# Altium project OSV_PSB_V2I1.PrjPcb (part 2 of 3)
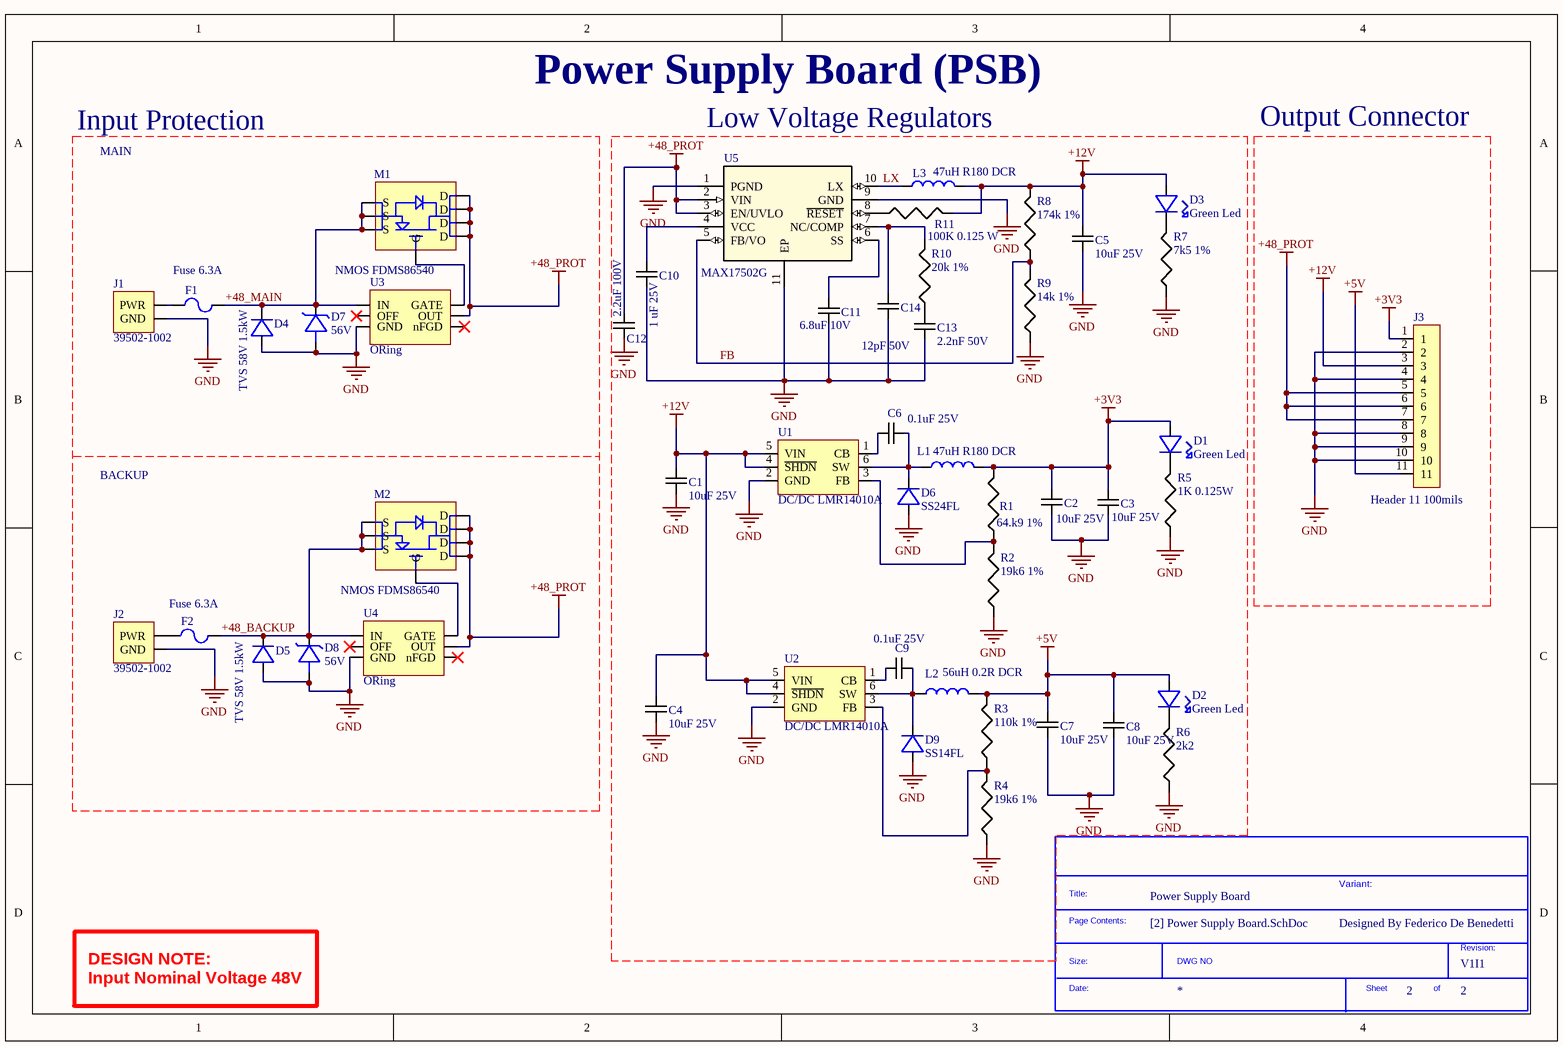
[diagram p2: [2] Power Supply Board.SchDoc]

## Sheet [2] Power Supply Board.SchDoc (continued)
### Library data of the parts
C1-C5 C7 C8 = GRM21BC81E106ME51L: CAP CER 10UF 25V X6S 0805; Manufacturer: Murata; Tolerance: 20%; Supplier 1: Digi-Key; Manufacturer Part Number: GRM21BC81E106ME51L; RoHS: Yes; Category: Ceramic Capacitors; Stock 1: 169515; Pricing 1: 1=0,37000, 10=0,25900, 100=0,15560, 500=0,11670, 1000=0,09854 (USD); Mount: Surface Mount; Case/Package: 0805; Case Code (Imperial): 0805; Case Code (Metric): 2012; Min Operating Temperature: -55°C; Max Operating Temperature: 105°C; Voltage Rating (DC): 25V; Dielectric: X6S; Packaging: Cut Tape; Capacitance: 10uF; Voltage Rating: 25V; Length: 0.079inch; Width: 0.049inch; Thickness: 0.055inch; ComponentLink1URL: http://search.murata.co.jp/Ceramy/image/img/A01X/G101/ENG/GRM21BC81E106ME51-01.pdf?src-supplier=Digi-Key; ComponentLink1Description: http://search.murata.co.jp/Ceramy/image/img/A01X/G101/ENG/GRM21BC81E106ME51-01.pdf?src-supplier=Digi-Key; Supplier Part Number 1: 490-10503-1-ND
C6 C9 = 08053C104KAT2A: CAP CER 0.1UF 25V X7R 0805; Manufacturer: Kyocera AVX; Capacitance: 100nF; Tolerance: 10%; Dissipation Factor: 3%; Insulation Resistance: 100GR; Supplier 1: Digi-Key; Manufacturer Part Number: 08053C104KAT2A; Stock 1: 40000; Pricing 1: 1=0.2, 10=0.144, 100=0.0675, 500=0.04736, 1000=0.0392 (USD); Mount: PCB,Surface Mount; Case/Package: 0805; Number of Pins: 2; Case Code (Imperial): 0805; Case Code (Metric): 2012; Contact Plating: Matte,Tin; Min Operating Temperature: -55°C; Max Operating Temperature: 125°C; Voltage Rating: 25V; Packaging: Tape and Reel; Package Quantity: 1; Dielectric: X7R; Voltage Rating (DC): 25V; Termination: SMD/SMT; Voltage: 25V; Length: 2.01mm; Height: 0.94mm; Width: 0.049inch; Thickness: 0.037inch; Depth: 1.25mm; Radiation Hardening: No; REACH SVHC: No SVHC; Lead Free: Lead Free; ComponentLink1URL: http://uk.rs-online.com/webdocs/13cc/0900766b813cc99b.pdf; ComponentLink1Description: http://uk.rs-online.com/webdocs/13cc/0900766b813cc99b.pdf; ComponentLink2URL: http://www.avx.com/docs/catalogs/cx7r.pdf; ComponentLink2Description: http://www.avx.com/docs/catalogs/cx7r.pdf; ComponentLink3URL: http://www.jameco.com/Jameco/Products/ProdDS/1929276.pdf; ComponentLink3Description: http://www.jameco.com/Jameco/Products/ProdDS/1929276.pdf; ComponentLink4URL: http://datasheets.avx.com/AutoMLCC.pdf; ComponentLink4Description: http://datasheets.avx.com/AutoMLCC.pdf; ComponentLink5URL: http://avx.com/docs/Catalogs/cx7r.pdf; ComponentLink5Description: http://avx.com/docs/Catalogs/cx7r.pdf; ComponentLink6URL: http://www.alliedelec.com/m/d/a24bb5190bea413b2ff164816f55e87c.pdf; ComponentLink6Description: http://www.alliedelec.com/m/d/a24bb5190bea413b2ff164816f55e87c.pdf; ComponentLink7URL: http://www.mouser.com/ds/2/40/X7RDielectric-777024.pdf; ComponentLink7Description: http://www.mouser.com/ds/2/40/X7RDielectric-777024.pdf; ComponentLink8URL: http://catalogs.avx.com/SurfaceMount.pdf; ComponentLink8Description: http://catalogs.avx.com/SurfaceMount.pdf; Supplier Part Number 1: 478-3755-1-ND
C10 = CL21B105KAFNNNE: Cap Ceramic 1uF 25V X7R 10% SMD 0805 125C T/R; Manufacturer: Samsung; Supplier 1: Digi-Key; Manufacturer Part Number: CL21B105KAFNNNE; Stock 1: 1714091; Pricing 1: 1=0.1, 10=0.076, 100=0.0338, 500=0.02416, 1000=0.01898 (USD); Mount: Surface Mount; Case/Package: 0805; Contact Plating: Tin; Case Code (Metric): 2012; Case Code (Imperial): 0805; Min Operating Temperature: -55°C; Max Operating Temperature: 125°C; Packaging: Tape and Reel; Package Quantity: 1; Capacitance: 1uF; Tolerance: 10%; Voltage Rating: 25V; Dielectric: X7R; Voltage: 25V; Voltage Rating (DC): 25V; Length: 2mm; Height: 1.25mm; Depth: 1.25mm; Width: 0.049inch; Thickness: 0.053inch; Radiation Hardening: No; Lead Free: Lead Free; ComponentLink1URL: https://media.digikey.com/pdf/Data%20Sheets/Samsung%20PDFs/CL_Series_MLCC_ds.pdf?src-supplier=Digi-Key; ComponentLink1Description: https://media.digikey.com/pdf/Data%20Sheets/Samsung%20PDFs/CL_Series_MLCC_ds.pdf?src-supplier=Digi-Key; ComponentLink2URL: https://www.verical.com/server-webapp/html/getDatasheet?partID=355205&src-supplier=Verical; ComponentLink2Description: https://www.verical.com/server-webapp/html/getDatasheet?partID=355205&src-supplier=Verical; Supplier Part Number 1: 1276-1066-1-ND
C11 = C2012X7R1A685K125AC: CAP CER 6.8UF 10V X7R 0805; Manufacturer: TDK; Dielectric Material: Ceramic; Tolerance: 10%; Supplier 1: Digi-Key; Manufacturer Part Number: C2012X7R1A685K125AC; RoHS: Yes; Category: Ceramic Capacitors; Stock 1: 4078; Pricing 1: 1=0,46000, 10=0,31600, 100=0,18980, 500=0,14232, 1000=0,12018 (USD); Mount: Surface Mount; Case/Package: 0805; Case Code (Metric): 5032; Case Code (Imperial): 2012; Min Operating Temperature: -55°C; Max Operating Temperature: 125°C; Termination: SMD/SMT; Voltage Rating (DC): 10V; Dielectric: X7R; Package Quantity: 2000; Packaging: Tape and Reel; Capacitance: 6.8uF; Voltage Rating: 10V; Length: 0.079inch; Width: 0.049inch; Thickness: 0.057inch; Lead Free: Lead Free; ComponentLink1URL: https://datasheet.ciiva.com/14909/tdkmlcccaprange-14909278.pdf?src-supplier=Digi-Key; ComponentLink1Description: https://datasheet.ciiva.com/14909/tdkmlcccaprange-14909278.pdf?src-supplier=Digi-Key; ComponentLink2URL: https://datasheet.ciiva.com/14909/tdkmlcccaprange-14909279.pdf?src-supplier=Digi-Key; ComponentLink2Description: https://datasheet.ciiva.com/14909/tdkmlcccaprange-14909279.pdf?src-supplier=Digi-Key; Supplier Part Number 1: 445-14529-1-ND
C12 = GCM31CC72A225KE02L: Cap Ceramic 2.2uF 100V X7S 10% Pad SMD 1206 125C Automotive T/R; Manufacturer: Murata; Supplier 1: Digi-Key; Manufacturer Part Number: GCM31CC72A225KE02L; RoHS: No; Category: Ceramic Capacitors; Stock 1: 99576; Pricing 1: 1=0,90000, 10=0,66100, 100=0,45330, 500=0,35886, 1000=0,30220 (USD); Mount: Surface Mount; Case/Package: 1206; Case Code (Imperial): 1206; Case Code (Metric): 3216; Min Operating Temperature: -55°C; Max Operating Temperature: 125°C; Packaging: Cut Tape; Capacitance: 2.2uF; Tolerance: 10%; Voltage Rating: 100V; Ratings: AEC-Q200; ComponentLink1URL: http://search.murata.co.jp/Ceramy/image/img/A01X/partnumbering_e_02.pdf?src-supplier=Digi-Key; ComponentLink1Description: http://search.murata.co.jp/Ceramy/image/img/A01X/partnumbering_e_02.pdf?src-supplier=Digi-Key; ComponentLink2URL: http://search.murata.co.jp/Ceramy/image/img/A01X/G101/ENG/GCM31CC72A225KE02-01.pdf?src-supplier=Digi-Key; ComponentLink2Description: http://search.murata.co.jp/Ceramy/image/img/A01X/G101/ENG/GCM31CC72A225KE02-01.pdf?src-supplier=Digi-Key; Supplier Part Number 1: 490-14438-1-ND
C13 = C0805C222K5RACTU: Cap Ceramic 2.2nF 50V X7R 10% SMD 0805 125°C Paper T/R; Manufacturer: KEMET; Supplier 1: Digi-Key; Manufacturer Part Number: C0805C222K5RACTU; RoHS: Yes; Category: Ceramic Capacitors; Stock 1: 406273; Pricing 1: 1=0,10000, 10=0,06000, 100=0,02670, 500=0,01906, 1000=0,01497 (USD); Mount: Surface Mount; Case/Package: 0805; Dielectric Material: Ceramic; Min Operating Temperature: -55°C; Max Operating Temperature: 125°C; Tolerance: 10%; Packaging: Tape and Reel; Capacitance: 2.2nF; Dielectric: X7R; Voltage Rating (DC): 50V; Voltage: 50V; Length: 2mm; Height: 0.78mm; Depth: 1.25mm; Radiation Hardening: No; ComponentLink1URL: https://datasheet.ciiva.com/28692/1851736-28692973.pdf?src-supplier=Element14; ComponentLink1Description: https://datasheet.ciiva.com/28692/1851736-28692973.pdf?src-supplier=Element14; ComponentLink2URL: https://datasheet.ciiva.com/28584/kem-c1002-x7r-smd-28584143.pdf?src-supplier=Element14; ComponentLink2Description: https://datasheet.ciiva.com/28584/kem-c1002-x7r-smd-28584143.pdf?src-supplier=Element14; Supplier Part Number 1: 399-1151-1-ND
C14 = C0805C120J5GACTU: Cap Ceramic 12PF, 50V, 0805, REEL; Manufacturer: KEMET; Tolerance: 5%; Dielectric: C0G; Dissipation Factor: 0.1%; Temperature Coefficient: 30ppm/°C; Supplier 1: Digi-Key; Manufacturer Part Number: C0805C120J5GACTU; RoHS: Yes; Category: Ceramic Capacitors; Stock 1: 92109; Pricing 1: 1=0,15000, 10=0,10700, 100=0,05010, 500=0,03512, 1000=0,02908 (USD); Mount: Surface Mount,PCB; Case/Package: 0805; Number of Pins: 2; Contact Material: Tin; Case Code (Metric): 2012; Case Code (Imperial): 0805; Dielectric Material: Ceramic; Min Operating Temperature: -55°C; Max Operating Temperature: 125°C; Package Quantity: 1; Capacitance: 12pF; Voltage Rating: 50V; Packaging: Tape and Reel; Voltage Rating (DC): 50V; Termination: SMD/SMT; Voltage: 50V; Length: 2mm; Height: 0.78mm; Width: 0.049inch; Thickness: 0.035inch; Lead Pitch: 0.75mm; Depth: 1.25mm; Radiation Hardening: No; REACH SVHC: No SVHC; Lead Free: Lead Free; ComponentLink1URL: https://datasheet.ciiva.com/6136/1732692-6136713.pdf?src-supplier=Farnell; ComponentLink1Description: https://datasheet.ciiva.com/6136/1732692-6136713.pdf?src-supplier=Farnell; ComponentLink2URL: https://datasheet.ciiva.com/144/docfinderpartnumber-c0805c120j5gactu-144980.pdf?src-supplier=Digi-Key; ComponentLink2Description: https://datasheet.ciiva.com/144/docfinderpartnumber-c0805c120j5gactu-144980.pdf?src-supplier=Digi-Key; ComponentLink3URL: https://datasheet.ciiva.com/11463/kem-c1003-c0g-smd-11463493.pdf?src-supplier=Avnet; ComponentLink3Description: https://datasheet.ciiva.com/11463/kem-c1003-c0g-smd-11463493.pdf?src-supplier=Avnet; ComponentLink4URL: https://datasheet.ciiva.com/18193/getdatasheetpartid-179336-18193526.pdf?src-supplier=Verical; ComponentLink4Description: https://datasheet.ciiva.com/18193/getdatasheetpartid-179336-18193526.pdf?src-supplier=Verical; ComponentLink5URL: https://datasheet.ciiva.com/5418/kem-c1003-c0g-smd-356956-5418089.pdf?src-supplier=Mouser; ComponentLink5Description: https://datasheet.ciiva.com/5418/kem-c1003-c0g-smd-356956-5418089.pdf?src-supplier=Mouser; ComponentLink6URL: https://datasheet.ciiva.com/7842/1732692-7842203.pdf?src-supplier=Element14; ComponentLink6Description: https://datasheet.ciiva.com/7842/1732692-7842203.pdf?src-supplier=Element14; ComponentLink7URL: https://datasheet.ciiva.com/7842/1732692-7842204.pdf?src-supplier=Element14; ComponentLink7Description: https://datasheet.ciiva.com/7842/1732692-7842204.pdf?src-supplier=Element14; ComponentLink8URL: https://datasheet.ciiva.com/14586/70095383-14586716.pdf?src-supplier=Allied+Electronics; ComponentLink8Description: https://datasheet.ciiva.com/14586/70095383-14586716.pdf?src-supplier=Allied+Electronics; ComponentLink9URL: https://datasheet.ciiva.com/28696/1789732-28696013.pdf?src-supplier=Element14; ComponentLink9Description: https://datasheet.ciiva.com/28696/1789732-28696013.pdf?src-supplier=Element14; Supplier Part Number 1: 399-1110-1-ND
D1-D3 = 598-8170-107F: LED 0805 GREEN 20MCD; Manufacturer: Dialight; Lens Color: Colorless,Clear; Lens Transparency: Clear; Reverse Voltage: 5V; Lens Style: Flat,Rectangular,Clear,Diffused,Colorless; Forward Voltage: 2.4V; Viewing Angle: 140°; Wavelength: 570nm; Forward Current: 20mA; Number of LEDs: 1; Power Dissipation: 60mW; Lens Size: 1.25mm; Supplier 1: Digi-Key; Manufacturer Part Number: 598-8170-107F; RoHS: Yes; Category: LEDs; Stock 1: 101069; Pricing 1: 1=0,39000, 10=0,28200, 100=0,12520, 500=0,08766, 1000=0,07201 (USD); Mount: Surface Mount; Case/Package: 0805; Number of Pins: 2; Case Code (Imperial): 0805; Case Code (Metric): 2012; Color: Green; Min Operating Temperature: -30°C; Max Operating Temperature: 85°C; Package Quantity: 3000; Packaging: Tape and Reel; Luminous Intensity: 20mcd; Illumination Color: Green; Test Current: 20mA; Dominant Wavelength: 570nm; Number of Elements: 1; Length: 2mm; Height: 0.8mm; Width: 1.25mm; Depth: 1.25mm; Radiation Hardening: No; REACH SVHC: No SVHC; Lead Free: Lead Free; ComponentLink1URL: https://datasheet.ciiva.com/11774/0900766b80ae2984-11774107.pdf?src-supplier=RSComponents; ComponentLink1Description: https://datasheet.ciiva.com/11774/0900766b80ae2984-11774107.pdf?src-supplier=RSComponents; ComponentLink2URL: https://datasheet.ciiva.com/15117/getdatasheetpartid-104614-15117453.pdf?src-supplier=Verical; ComponentLink2Description: https://datasheet.ciiva.com/15117/getdatasheetpartid-104614-15117453.pdf?src-supplier=Verical; ComponentLink3URL: https://datasheet.ciiva.com/2110/smt-selector-guide-2110053.pdf?src-supplier=Digi-Key; ComponentLink3Description: https://datasheet.ciiva.com/2110/smt-selector-guide-2110053.pdf?src-supplier=Digi-Key; ComponentLink4URL: https://datasheet.ciiva.com/1243/25662-1243901.pdf?src-supplier=Element14; ComponentLink4Description: https://datasheet.ciiva.com/1243/25662-1243901.pdf?src-supplier=Element14; ComponentLink5URL: https://datasheet.ciiva.com/30132/mdei5980805-a-w-30132781.pdf?src-supplier=Onlinecomponents.com; ComponentLink5Description: https://datasheet.ciiva.com/30132/mdei5980805-a-w-30132781.pdf?src-supplier=Onlinecomponents.com; ComponentLink6URL: https://datasheet.ciiva.com/2110/smt-selector-guide-2110051.pdf?src-supplier=Digi-Key; ComponentLink6Description: https://datasheet.ciiva.com/2110/smt-selector-guide-2110051.pdf?src-supplier=Digi-Key; ComponentLink7URL: https://datasheet.ciiva.com/2110/smt-selector-guide-2110052.pdf?src-supplier=Digi-Key; ComponentLink7Description: https://datasheet.ciiva.com/2110/smt-selector-guide-2110052.pdf?src-supplier=Digi-Key; ComponentLink8URL: https://datasheet.ciiva.com/15965/mdei5980805-a-w-15965496.pdf?src-supplier=Onlinecomponents.com; ComponentLink8Description: https://datasheet.ciiva.com/15965/mdei5980805-a-w-15965496.pdf?src-supplier=Onlinecomponents.com; ComponentLink9URL: https://datasheet.ciiva.com/22748/1484480-22748121.pdf?src-supplier=Element14; ComponentLink9Description: https://datasheet.ciiva.com/22748/1484480-22748121.pdf?src-supplier=Element14; ComponentLink10URL: https://datasheet.ciiva.com/1243/25662-1243902.pdf?src-supplier=Element14; ComponentLink10Description: https://datasheet.ciiva.com/1243/25662-1243902.pdf?src-supplier=Element14; Supplier Part Number 1: 350-2044-1-ND
D4 D5 = SMCJ58CA: TVS DIODE 58VWM 93.6VC SMC; Manufacturer: Littelfuse; Leakage Current: 1uA; Breakdown Voltage: 64.4V; Number of Channels: 1; Clamping Voltage: 93.6V; Polarity: Bidirectional; Power Line Protection: No; Peak Pulse Current: 16.1A; Test Current: 1mA; Max Breakdown Voltage: 71.2V; Max Power Dissipation: 6.5W; Supplier 1: Digi-Key; Manufacturer Part Number: SMCJ58CA; RoHS: Yes; Category: TVS Diodes; Stock 1: 5077; Pricing 1: 1=0,61000, 10=0,52500, 25=0,49000, 100=0,36400, 250=0,34580, 500=0,28420, 1000=0,23100 (USD); Mount: Surface Mount; Number of Pins: 2; Min Operating Temperature: -65°C; Max Operating Temperature: 150°C; Voltage Rating (DC): 58V; Peak Pulse Power: 1.5kW; Termination: SMD/SMT; Number of Bidirectional Channels: 1; Direction: Bidirectional; Reverse Standoff Voltage: 58V; Min Breakdown Voltage: 64.4V; Reverse Breakdown Voltage: 64.4V; Packaging: Tape and Reel; Number of Elements: 1; Package Quantity: 3000; Operating Supply Voltage: 58V; Power Dissipation: 1.5kW; Max Surge Current: 16.1A; Composition: Zener; Length: 8.13mm; Height: 2.62mm; Width: 6.22mm; Lead Free: Lead Free; REACH SVHC: No SVHC; ComponentLink1URL: https://datasheet.ciiva.com/16388/smcj58ca-16388266.pdf?src-supplier=Future+Electronics; ComponentLink1Description: https://datasheet.ciiva.com/16388/smcj58ca-16388266.pdf?src-supplier=Future+Electronics; ComponentLink2URL: https://datasheet.ciiva.com/4509/littelfuse-tvs-diode-smcj-62645-4509016.pdf?src-supplier=Mouser; ComponentLink2Description: https://datasheet.ciiva.com/4509/littelfuse-tvs-diode-smcj-62645-4509016.pdf?src-supplier=Mouser; ComponentLink3URL: https://datasheet.ciiva.com/332/littelfuse-tvs-diode-smcj-datasheet-pdf-332399.pdf?src-supplier=Digi-Key; ComponentLink3Description: https://datasheet.ciiva.com/332/littelfuse-tvs-diode-smcj-datasheet-pdf-332399.pdf?src-supplier=Digi-Key; ComponentLink4URL: https://datasheet.ciiva.com/332/littelfuse-tvs-diode-smcj-datasheet-pdf-332397.pdf?src-supplier=Digi-Key; ComponentLink4Description: https://datasheet.ciiva.com/332/littelfuse-tvs-diode-smcj-datasheet-pdf-332397.pdf?src-supplier=Digi-Key; ComponentLink5URL: https://datasheet.ciiva.com/332/littelfuse-tvs-diode-smcj-datasheet-pdf-332398.pdf?src-supplier=Digi-Key; ComponentLink5Description: https://datasheet.ciiva.com/332/littelfuse-tvs-diode-smcj-datasheet-pdf-332398.pdf?src-supplier=Digi-Key; Supplier Part Number 1: SMCJ58CALFCT-ND
D6 = SS24FL: Diode SCHOTTKY  40V 2S SOD123F; Manufacturer: ON Semiconductor / Fairchild; Average Rectified Current: 2A; Reverse Recovery Time: 9.495ns; Element Configuration: Single; Max Forward Surge Current (Ifsm): 50A; Supplier 1: Digi-Key; Manufacturer Part Number: SS24FL; RoHS: Yes; Category: Rectifier Diodes; Stock 1: 15493; Pricing 1: 1=0,31000, 10=0,25000, 25=0,20960, 100=0,10250, 250=0,10088, 500=0,08552, 1000=0,05942 (USD); Mount: Surface Mount; Case/Package: SOD; Number of Pins: 2; Weight: 0.0276g; Packaging: Tape and Reel; Max Reverse Voltage (DC): 40V; Max Repetitive Reverse Voltage (Vrrm): 40V; ComponentLink1URL: http://www.farnell.com/datasheets/2552652.pdf?src-supplier=Farnell; ComponentLink1Description: http://www.farnell.com/datasheets/2552652.pdf?src-supplier=Farnell; ComponentLink2URL: https://www.fairchildsemi.com/datasheets/SS/SS24FL.pdf?src-supplier=Digi-Key; ComponentLink2Description: https://www.fairchildsemi.com/datasheets/SS/SS24FL.pdf?src-supplier=Digi-Key; ComponentLink3URL: http://www.farnell.com/datasheets/2552652.pdf?src-supplier=Newark; ComponentLink3Description: http://www.farnell.com/datasheets/2552652.pdf?src-supplier=Newark; ComponentLink4URL: http://www.farnell.com/datasheets/2552652.pdf?src-supplier=Element14; ComponentLink4Description: http://www.farnell.com/datasheets/2552652.pdf?src-supplier=Element14; Supplier Part Number 1: SS24FLCT-ND
D7 D8 = 1SMA5943BT3G: Diodes Zener 56V 1.5W; Manufacturer: ON Semiconductor; Impedance: 86R; Max Reverse Leakage Current: 500nA; Voltage Tolerance: 5%; Power Dissipation: 500mW; Zener Current: 27mA; Test Current: 6.7mA; Breakdown Voltage: 58.8V; Forward Voltage: 1.5V; Element Configuration: Single; Supplier 1: Digi-Key; Manufacturer Part Number: 1SMA5943BT3G; RoHS: Yes; Category: Zener Diodes; Stock 1: 25856; Pricing 1: 1=0,43000, 10=0,32200, 25=0,29040, 100=0,15310, 250=0,15152, 500=0,13570, 1000=0,10560, 2500=0,09662 (USD); Case/Package: SMA; Number of Pins: 2; Min Operating Temperature: -65°C; Max Operating Temperature: 150°C; Packaging: Tape and Reel; Zener Voltage: 56V; Max Power Dissipation: 1.5W; Power Rating: 1.5W; Voltage Rating (DC): 56V; Tolerance: 5%; Working Voltage: 56V; Package Quantity: 1; Peak Reverse Current: 500nA; Length: 4.57mm; Height: 2.05mm; Width: 2.92mm; Radiation Hardening: No; Lead Free: Lead Free; Halogen Free: Halogen Free; REACH SVHC: No SVHC; ComponentLink1URL: https://datasheet.ciiva.com/15142/getdatasheetpartid-53895-15142138.pdf?src-supplier=Verical; ComponentLink1Description: https://datasheet.ciiva.com/15142/getdatasheetpartid-53895-15142138.pdf?src-supplier=Verical; ComponentLink2URL: https://datasheet.ciiva.com/4733/1sma5913bt3-d-4733669.pdf?src-supplier=Mouser; ComponentLink2Description: https://datasheet.ciiva.com/4733/1sma5913bt3-d-4733669.pdf?src-supplier=Mouser; ComponentLink3URL: https://datasheet.ciiva.com/16311/1sma5913bt3-d-16311897.pdf?src-supplier=Future+Electronics; ComponentLink3Description: https://datasheet.ciiva.com/16311/1sma5913bt3-d-16311897.pdf?src-supplier=Future+Electronics; ComponentLink4URL: https://datasheet.ciiva.com/6388/1sma5913bt3-d-6388892.pdf?src-supplier=Digi-Key; ComponentLink4Description: https://datasheet.ciiva.com/6388/1sma5913bt3-d-6388892.pdf?src-supplier=Digi-Key; ComponentLink5URL: https://datasheet.ciiva.com/6388/1sma5913bt3-d-6388890.pdf?src-supplier=Digi-Key; ComponentLink5Description: https://datasheet.ciiva.com/6388/1sma5913bt3-d-6388890.pdf?src-supplier=Digi-Key; ComponentLink6URL: https://datasheet.ciiva.com/6388/1sma5913bt3-d-6388891.pdf?src-supplier=Digi-Key; ComponentLink6Description: https://datasheet.ciiva.com/6388/1sma5913bt3-d-6388891.pdf?src-supplier=Digi-Key; Supplier Part Number 1: 1SMA5943BT3GOSCT-ND
D9 = SS14FL: DIODE SCHOTTKY 40V 1A SOD123F; Manufacturer: ON Semiconductor / Fairchild; Reverse Recovery Time: 5.695ns; Element Configuration: Single; Max Forward Surge Current (Ifsm): 40A; Supplier 1: Digi-Key; Manufacturer Part Number: SS14FL; RoHS: Yes; Category: Rectifier Diodes; Stock 1: 33301; Pricing 1: 1=0,25000, 10=0,20900, 25=0,17480, 100=0,08540, 250=0,08400, 500=0,07120, 1000=0,04947 (USD); Mount: Surface Mount; Case/Package: SOD; Weight: 0.0276g; Packaging: Tape and Reel; Average Rectified Current: 1A; Max Reverse Voltage (DC): 40V; Max Repetitive Reverse Voltage (Vrrm): 40V; ComponentLink1URL: http://www.farnell.com/datasheets/2552650.pdf?src-supplier=Farnell; ComponentLink1Description: http://www.farnell.com/datasheets/2552650.pdf?src-supplier=Farnell; ComponentLink2URL: https://www.fairchildsemi.com/datasheets/SS/SS13FL.pdf?src-supplier=Digi-Key; ComponentLink2Description: https://www.fairchildsemi.com/datasheets/SS/SS13FL.pdf?src-supplier=Digi-Key; ComponentLink3URL: https://www.onsemi.com/pub/Collateral/SS14FL-D.PDF?src-supplier=Digi-Key; ComponentLink3Description: https://www.onsemi.com/pub/Collateral/SS14FL-D.PDF?src-supplier=Digi-Key; Supplier Part Number 1: SS14FLCT-ND
F1 F2 = SF-2410FP630W-2: Fuse 2410 SMD FAST-ACTING PRECISION W; Manufacturer: Bourns; Fuse Type: Board Mount (Cartridge Style Excluded); Voltage Rating (AC): 125V; DC Cold Resistance: 10mR; Approvals: UL; Supplier 1: Digi-Key; Manufacturer Part Number: SF-2410FP630W-2; RoHS: No; Stock 1: 1970; Pricing 1: 1=1,16000, 5=1,12600, 10=1,05300, 50=0,87120, 100=0,72600, 250=0,70784, 500=0,59896, 1000=0,52635 (USD); Mount: Surface Mount; Case/Package: 2410; Case Code (Imperial): 2410; Case Code (Metric): 6125; Min Operating Temperature: -55°C; Max Operating Temperature: 125°C; Packaging: Tape and Reel; Current Rating: 6.3A; Voltage Rating (DC): 125V; ComponentLink1URL: https://www.bourns.com/docs/Product-Datasheets/SF-2410FPxxxW.pdf?src-supplier=Digi-Key; ComponentLink1Description: https://www.bourns.com/docs/Product-Datasheets/SF-2410FPxxxW.pdf?src-supplier=Digi-Key; Supplier Part Number 1: SF-2410FP630W-2CT-ND
J1 J2 = 39502-1002: Terminal Block,2 Contacts,PIN ;RoHS Compliant: Yes; Manufacturer: Molex; Number of Positions: 2; Contact Resistance: 8mR; Current Rating: 8A; Voltage Rating: 300V; Pitch: 3.5mm; Supplier 1: Digi-Key; Manufacturer Part Number: 39502-1002; RoHS: Yes; Category: Headers and Wire Housings; Stock 1: 12700; Pricing 1: 1=0,58000, 10=0,54000, 100=0,41400, 500=0,36000, 1000=0,29700, 5000=0,26100, 10000=0,24300 (USD); Mount: Through Hole; Color: Black; Contact Plating: Tin; Housing Material: Nylon; Contact Material: Brass; Housing Color: Black; Min Operating Temperature: -40°C; Max Operating Temperature: 105°C; Termination: Through Hole; Number of Rows: 1; Orientation: Horizontal; Number of Contacts: 2; Package Quantity: 1800; Number of Circuits: 2; Length: 8.4mm; Width: 9.2mm; Flammability Rating: UL94 V-0; REACH SVHC: No SVHC; ELV: Compliant; Halogen Free: Low Halogen; Lead Free: Lead Free; ComponentLink1URL: https://datasheet.ciiva.com/5192/0395021002-terminal-blocks-163773-5192965.pdf?src-supplier=Mouser; ComponentLink1Description: https://datasheet.ciiva.com/5192/0395021002-terminal-blocks-163773-5192965.pdf?src-supplier=Mouser; Supplier Part Number 1: WM7770-ND
J3 = PREC011SAAN-RC: HEADER 11 pins Male 2.54MM; Manufacturer: Sullins; Number of Positions: 11; Connector Type: Male Pin; Pitch: 0.1inch; Supplier 1: Digi-Key; Manufacturer Part Number: PREC011SAAN-RC; RoHS: Yes; Category: Connectors; Stock 1: 2584; Pricing 1: 1=0,26000, 10=0,24500, 25=0,20920, 50=0,18300, 100=0,16990, 250=0,15028, 500=0,14374 (USD); Mount: Through Hole; Contact Plating: Tin; Color: Black; Package Quantity: 1; Number of Rows: 1; Packaging: Bulk; Termination: Solder; Contact Mating Length: 0.23inch; ComponentLink1URL: https://datasheet.ciiva.com/740/zrzczzzszzn-rc-st-11635-b-740834.pdf?src-supplier=Digi-Key; ComponentLink1Description: https://datasheet.ciiva.com/740/zrzczzzszzn-rc-st-11635-b-740834.pdf?src-supplier=Digi-Key; Supplier Part Number 1: S1012EC-11-ND
L1 L3 = SDE0805A-470K: Inductor 47UH,  10%, 0.18 ohm, 1.7 A; Manufacturer: Bourns; Core Material: Ferrite; Current Rating: 1.7A; Saturation Current: 1.4A; Shielding: Unshielded; DC Resistance (DCR): 180mR; Self Resonant Frequency: 12.1MHz; Test Frequency: 1MHz; Supplier 1: Digi-Key; Manufacturer Part Number: SDE0805A-470K; RoHS: Yes; Category: Fixed Inductors; Stock 1: 2269; Pricing 1: 1=0,74000, 10=0,64400, 100=0,46000, 500=0,38640 (USD); Mount: Surface Mount; Case/Package: Nonstandard; Min Operating Temperature: -40°C; Max Operating Temperature: 125°C; Inductance Tolerance: 10%; Packaging: Tape and Reel; Composition: Wirewound; Inductance: 47uH; Tolerance: 10%; Termination: SMD/SMT; RMS Current (Irms): 1.7A; Length: 0.307inch; Width: 0.276inch; Height - Seated (Max): 0.217inch; Ratings: AEC-Q200; REACH SVHC: No SVHC; ComponentLink1URL: http://www.alliedelec.com/images/products/datasheets/bm/BOURNS/70480912.pdf?src-supplier=Allied+Electronics; ComponentLink1Description: http://www.alliedelec.com/images/products/datasheets/bm/BOURNS/70480912.pdf?src-supplier=Allied+Electronics; ComponentLink2URL: http://www.farnell.com/datasheets/1865596.pdf?src-supplier=Farnell; ComponentLink2Description: http://www.farnell.com/datasheets/1865596.pdf?src-supplier=Farnell; ComponentLink3URL: http://www.bourns.com/docs/Product-Datasheets/SDE0805A.pdf?src-supplier=Digi-Key; ComponentLink3Description: http://www.bourns.com/docs/Product-Datasheets/SDE0805A.pdf?src-supplier=Digi-Key; ComponentLink4URL: https://www.bourns.com/docs/Product-Datasheets/SDE0805A.pdf?src-supplier=Digi-Key; ComponentLink4Description: https://www.bourns.com/docs/Product-Datasheets/SDE0805A.pdf?src-supplier=Digi-Key; ComponentLink5URL: http://www.farnell.com/datasheets/1865596.pdf?src-supplier=Element14; ComponentLink5Description: http://www.farnell.com/datasheets/1865596.pdf?src-supplier=Element14; Supplier Part Number 1: SDE0805A-470KCT-ND
L2 = SDE0805A-560K: Inductor 56UH,  10%, 0.2 ohm, 1.6 A; Manufacturer: Bourns; Core Material: Ferrite; Current Rating: 1.6A; Saturation Current: 1.2A; Shielding: Unshielded; DC Resistance (DCR): 240mR; Self Resonant Frequency: 11.5MHz; Test Frequency: 1MHz; Supplier 1: Digi-Key; Manufacturer Part Number: SDE0805A-560K; RoHS: Yes; Category: Fixed Inductors; Stock 1: 1006; Pricing 1: 1=0,74000, 10=0,64400, 100=0,46000, 500=0,38640 (USD); Mount: Surface Mount; Case/Package: Nonstandard; Min Operating Temperature: -40°C; Max Operating Temperature: 125°C; Tolerance: 10%; Inductance Tolerance: 10%; Packaging: Tape and Reel; Composition: Wirewound; Inductance: 56uH; RMS Current (Irms): 1.6A; Termination: SMD/SMT; Length: 0.307inch; Width: 0.276inch; Height - Seated (Max): 0.217inch; Ratings: AEC-Q200; REACH SVHC: No SVHC; ComponentLink1URL: https://datasheet.ciiva.com/48953/70480897-48953773.pdf?src-supplier=Allied+Electronics; ComponentLink1Description: https://datasheet.ciiva.com/48953/70480897-48953773.pdf?src-supplier=Allied+Electronics; ComponentLink2URL: https://datasheet.ciiva.com/46449/1865596-46449262.pdf?src-supplier=Element14; ComponentLink2Description: https://datasheet.ciiva.com/46449/1865596-46449262.pdf?src-supplier=Element14; Supplier Part Number 1: SDE0805A-560KCT-ND
M1 M2 = FDMS86540: MOSFET 60V N-Channel PowerTrench MOSFET; Manufacturer: ON Semiconductor / Fairchild; Continuous Drain Current (ID): 20A; Drain to Source Resistance: 3.4mR; Power Dissipation: 2.5W; Gate to Source Voltage (Vgs): 20V; Input Capacitance: 6.435nF; Rise Time: 16ns; Fall Time: 7.2ns; Turn-Off Delay Time: 32ns; Turn-On Delay Time: 28ns; Number of Elements: 1; Element Configuration: Single; Supplier 1: Digi-Key; Manufacturer Part Number: FDMS86540; RoHS: Yes; Category: MOSFETs; Stock 1: 1340; Pricing 1: 1=1,48000, 10=1,33200, 25=1,25640, 100=0,98010, 250=0,95496, 500=0,82930, 1000=0,70364 (USD); Mount: Surface Mount; Number of Pins: 8; Weight: 0.0681g; Min Operating Temperature: -55°C; Max Operating Temperature: 150°C; Packaging: Tape and Reel; Package Quantity: 3000; Rds On Max: 3.4mR; Drain to Source Voltage (Vdss): 60V; Max Power Dissipation: 2.5W; Drain to Source Breakdown Voltage: 60V; Length: 5mm; Height: 1.05mm; Width: 5.75mm; Radiation Hardening: No; ComponentLink1URL: https://datasheet.ciiva.com/6374/fdms86540-6374392.pdf?src-supplier=Digi-Key; ComponentLink1Description: https://datasheet.ciiva.com/6374/fdms86540-6374392.pdf?src-supplier=Digi-Key; ComponentLink2URL: https://datasheet.ciiva.com/15044/fdms86540-15044107.pdf?src-supplier=Digi-Key; ComponentLink2Description: https://datasheet.ciiva.com/15044/fdms86540-15044107.pdf?src-supplier=Digi-Key; ComponentLink3URL: https://datasheet.ciiva.com/11176/fdms86540-11176218.pdf?src-supplier=Avnet; ComponentLink3Description: https://datasheet.ciiva.com/11176/fdms86540-11176218.pdf?src-supplier=Avnet; ComponentLink4URL: https://datasheet.ciiva.com/15044/fdms86540-15044106.pdf?src-supplier=Digi-Key; ComponentLink4Description: https://datasheet.ciiva.com/15044/fdms86540-15044106.pdf?src-supplier=Digi-Key; ComponentLink5URL: https://datasheet.ciiva.com/15044/fdms86540-15044108.pdf?src-supplier=Digi-Key; ComponentLink5Description: https://datasheet.ciiva.com/15044/fdms86540-15044108.pdf?src-supplier=Digi-Key; Supplier Part Number 1: FDMS86540CT-ND
R1 = ERJ-6ENF6492V: Res Thick Film 0805 64K9 OHM 1% 1/8W 0805; Manufacturer: Panasonic; Max Power Dissipation: 125mW; Temperature Coefficient: 100ppm/°C; Voltage Rating (DC): 150V; Resistance: 64.9kR; Supplier 1: Digi-Key; Manufacturer Part Number: ERJ-6ENF6492V; RoHS: Yes; Category: Chip SMD Resistors; Stock 1: 66858; Pricing 1: 1=0,10000, 10=0,07200, 100=0,02750, 1000=0,01210, 2500=0,01045 (USD); Mount: Surface Mount; Case/Package: 0805; Contact Plating: Tin; Case Code (Metric): 2012; Case Code (Imperial): 0805; Min Operating Temperature: -55°C; Max Operating Temperature: 155°C; Features: Automotive AEC-Q200; Composition: Thick Film; Number of Terminations: 2; Military Standard: Not; Power Rating: 125mW; Tolerance: 1%; Packaging: Tape and Reel; Voltage Rating: 150V; Package Quantity: 1; Termination: SMD/SMT; Length: 2mm; Height: 0.6mm; Depth: 1.25mm; Width: 0.049inch; REACH SVHC: No SVHC; Lead Free: Lead Free; ComponentLink1URL: https://datasheet.ciiva.com/30165/aoa0000ce2-30165247.pdf?src-supplier=Onlinecomponents.com; ComponentLink1Description: https://datasheet.ciiva.com/30165/aoa0000ce2-30165247.pdf?src-supplier=Onlinecomponents.com; ComponentLink2URL: https://datasheet.ciiva.com/22673/1678782-22673574.pdf?src-supplier=Element14; ComponentLink2Description: https://datasheet.ciiva.com/22673/1678782-22673574.pdf?src-supplier=Element14; ComponentLink3URL: https://datasheet.ciiva.com/46420/1678782-46420311.pdf?src-supplier=Element14; ComponentLink3Description: https://datasheet.ciiva.com/46420/1678782-46420311.pdf?src-supplier=Element14; ComponentLink4URL: https://datasheet.ciiva.com/9188/aoa0000ce2-9188201.pdf?src-supplier=Avnet; ComponentLink4Description: https://datasheet.ciiva.com/9188/aoa0000ce2-9188201.pdf?src-supplier=Avnet; ComponentLink5URL: https://datasheet.ciiva.com/16779/70260748-16779469.pdf?src-supplier=Allied+Electronics; ComponentLink5Description: https://datasheet.ciiva.com/16779/70260748-16779469.pdf?src-supplier=Allied+Electronics; Supplier Part Number 1: P64.9KCCT-ND
R2 R4 = ERJ6ENF1962V: Res Thick Film 0805 19.6K Ohm 1% 1/8W 100ppm/C Molded SMD SMD Punched Carrier T/R; Manufacturer: Panasonic; Resistance: 19.6kR; Voltage Rating: 150V; Power Rating: 125mW; Temperature Coefficient: 100ppm/°C; Supplier 1: Digi-Key; Manufacturer Part Number: ERJ6ENF1962V; RoHS: Yes; Category: Chip SMD Resistors; Stock 1: 51667; Pricing 1: 1=0,10000, 10=0,07500, 100=0,02900, 1000=0,01274, 2500=0,01100 (USD); Mount: Surface Mount; Case/Package: 0805; Case Code (Imperial): 0805; Case Code (Metric): 2012; Contact Plating: Tin; Min Operating Temperature: -55°C; Max Operating Temperature: 155°C; Tolerance: 1%; Packaging: Tape and Reel; Composition: Thick Film; Voltage Rating (DC): 150V; Max Power Dissipation: 125mW; Package Quantity: 1; Number of Terminations: 2; Military Standard: Not; Features: Automotive AEC-Q200; Length: 2mm; Height: 0.028inch; Width: 1.2mm; Depth: 1.25mm; Radiation Hardening: No; REACH SVHC: No SVHC; Lead Free: Lead Free; ComponentLink1URL: https://datasheet.ciiva.com/43460/426256-43460053.pdf?src-supplier=Farnell; ComponentLink1Description: https://datasheet.ciiva.com/43460/426256-43460053.pdf?src-supplier=Farnell; ComponentLink2URL: https://datasheet.ciiva.com/6201/426256-6201515.pdf?src-supplier=Farnell; ComponentLink2Description: https://datasheet.ciiva.com/6201/426256-6201515.pdf?src-supplier=Farnell; ComponentLink3URL: https://datasheet.ciiva.com/9192/aoa0000ce2-9192205.pdf?src-supplier=Avnet; ComponentLink3Description: https://datasheet.ciiva.com/9192/aoa0000ce2-9192205.pdf?src-supplier=Avnet; ComponentLink4URL: https://datasheet.ciiva.com/30178/aoa0000ce2-30178750.pdf?src-supplier=Onlinecomponents.com; ComponentLink4Description: https://datasheet.ciiva.com/30178/aoa0000ce2-30178750.pdf?src-supplier=Onlinecomponents.com; ComponentLink5URL: https://datasheet.ciiva.com/46389/426256-46389918.pdf?src-supplier=Element14; ComponentLink5Description: https://datasheet.ciiva.com/46389/426256-46389918.pdf?src-supplier=Element14; ComponentLink6URL: https://datasheet.ciiva.com/17211/aoa0000ce2-17211151.pdf?src-supplier=Avnet+Europe; ComponentLink6Description: https://datasheet.ciiva.com/17211/aoa0000ce2-17211151.pdf?src-supplier=Avnet+Europe; ComponentLink7URL: https://datasheet.ciiva.com/46377/426256-46377964.pdf?src-supplier=Element14; ComponentLink7Description: https://datasheet.ciiva.com/46377/426256-46377964.pdf?src-supplier=Element14; Supplier Part Number 1: P19.6KCCT-ND
R3 = ERJ6ENF1103V: Res Thick Film 0805 110K OHM 1% 1/8W 0805; Manufacturer: Panasonic; Temperature Coefficient: 100ppm/°C; Max Power Dissipation: 125mW; Voltage Rating (DC): 150V; Resistance: 110kR; Supplier 1: Digi-Key; Manufacturer Part Number: ERJ6ENF1103V; RoHS: Yes; Category: Chip SMD Resistors; Stock 1: 49849; Pricing 1: 1=0,10000, 10=0,07200, 100=0,02750, 1000=0,01210, 2500=0,01045 (USD); Mount: Surface Mount; Case/Package: 0805; Weight: 0.000194oz; Contact Plating: Tin; Case Code (Imperial): 0805; Case Code (Metric): 2012; Min Operating Temperature: -55°C; Max Operating Temperature: 155°C; Composition: Thick Film; Termination: SMD/SMT; Number of Terminations: 2; Military Standard: Not; Features: Automotive AEC-Q200; Tolerance: 1%; Power Rating: 125mW; Voltage Rating: 150V; Packaging: Tape and Reel; Package Quantity: 1; Length: 2mm; Height: 0.6mm; Depth: 1.25mm; Width: 1.2mm; Radiation Hardening: No; Lead Free: Lead Free; REACH SVHC: Yes; ComponentLink1URL: https://datasheet.ciiva.com/16772/70260748-16772678.pdf?src-supplier=Allied+Electronics; ComponentLink1Description: https://datasheet.ciiva.com/16772/70260748-16772678.pdf?src-supplier=Allied+Electronics; ComponentLink2URL: https://datasheet.ciiva.com/16514/aoa0000ce2-16514025.pdf?src-supplier=Avnet+Asia; ComponentLink2Description: https://datasheet.ciiva.com/16514/aoa0000ce2-16514025.pdf?src-supplier=Avnet+Asia; ComponentLink3URL: https://datasheet.ciiva.com/16772/70260748-16772280.pdf?src-supplier=Allied+Electronics; ComponentLink3Description: https://datasheet.ciiva.com/16772/70260748-16772280.pdf?src-supplier=Allied+Electronics; ComponentLink4URL: https://datasheet.ciiva.com/30095/aoa0000ce2-30095081.pdf?src-supplier=Onlinecomponents.com; ComponentLink4Description: https://datasheet.ciiva.com/30095/aoa0000ce2-30095081.pdf?src-supplier=Onlinecomponents.com; ComponentLink5URL: https://datasheet.ciiva.com/7795/1678782-7795547.pdf?src-supplier=Element14; ComponentLink5Description: https://datasheet.ciiva.com/7795/1678782-7795547.pdf?src-supplier=Element14; ComponentLink6URL: https://datasheet.ciiva.com/17207/aoa0000ce2-17207915.pdf?src-supplier=Avnet+Europe; ComponentLink6Description: https://datasheet.ciiva.com/17207/aoa0000ce2-17207915.pdf?src-supplier=Avnet+Europe; ComponentLink7URL: https://datasheet.ciiva.com/46440/1678782-46440380.pdf?src-supplier=Element14; ComponentLink7Description: https://datasheet.ciiva.com/46440/1678782-46440380.pdf?src-supplier=Element14; Supplier Part Number 1: P110KCCT-ND
R5 = ERJ6ENF1001V: Res 0805, 1K, 0.125W; Manufacturer: Panasonic; Resistance: 1kR; Power Rating: 125mW; Tolerance: 1%; Temperature Coefficient: 100ppm/°C; Voltage Rating (DC): 150V; Supplier 1: Digi-Key; Manufacturer Part Number: ERJ6ENF1001V; Stock 1: 946321; Pricing 1: 1=0.1, 10=0.081, 100=0.0311, 1000=0.01367, 2500=0.01181 (USD); Mount: Surface Mount; Case/Package: 0805; Number of Pins: 2; Case Code (Metric): 2012; Case Code (Imperial): 0805; Contact Plating: Tin; Min Operating Temperature: -55°C; Max Operating Temperature: 155°C; Packaging: Tape and Reel; Number of Terminations: 2; Package Quantity: 1; Voltage Rating: 150V; Composition: Thick Film; Termination: SMD/SMT; Military Standard: Not; Max Power Dissipation: 125mW; Features: Automotive AEC-Q200; Length: 2mm; Height: 0.6mm; Width: 0.049inch; Depth: 1.25mm; Radiation Hardening: No; REACH SVHC: No SVHC; Lead Free: Lead Free; ComponentLink1URL: http://www.jameco.com/Jameco/Products/ProdDS/1988962.pdf?src-supplier=Jameco; ComponentLink1Description: http://www.jameco.com/Jameco/Products/ProdDS/1988962.pdf?src-supplier=Jameco; ComponentLink2URL: http://www.farnell.com/datasheets/426256.pdf?src-supplier=Element14; ComponentLink2Description: http://www.farnell.com/datasheets/426256.pdf?src-supplier=Element14; ComponentLink3URL: http://www.alliedelec.com/m/d/623f45ff1957d936ff56d46fd1c28cac.pdf?src-supplier=Allied+Electronics; ComponentLink3Description: http://www.alliedelec.com/m/d/623f45ff1957d936ff56d46fd1c28cac.pdf?src-supplier=Allied+Electronics; ComponentLink4URL: http://www.farnell.com/datasheets/1678782.pdf?src-supplier=Element14; ComponentLink4Description: http://www.farnell.com/datasheets/1678782.pdf?src-supplier=Element14; ComponentLink5URL: http://industrial.panasonic.com/www-data/pdf/AOA0000/AOA0000CE2.pdf?src-supplier=Avnet; ComponentLink5Description: http://industrial.panasonic.com/www-data/pdf/AOA0000/AOA0000CE2.pdf?src-supplier=Avnet; ComponentLink6URL: http://industrial.panasonic.com/www-data/pdf/AOA0000/AOA0000CE2.pdf?src-supplier=Future+Electronics; ComponentLink6Description: http://industrial.panasonic.com/www-data/pdf/AOA0000/AOA0000CE2.pdf?src-supplier=Future+Electronics; ComponentLink7URL: http://industrial.panasonic.com/www-data/pdf/AOA0000/AOA0000CE2.pdf?src-supplier=Avnet+Asia; ComponentLink7Description: http://industrial.panasonic.com/www-data/pdf/AOA0000/AOA0000CE2.pdf?src-supplier=Avnet+Asia; Supplier Part Number 1: P1.00KCDKR-ND
R6 = ERJ6ENF2201V: Res Thick Film 00805 2.2K 1% 1/8W 0805; Manufacturer: Panasonic; Resistance: 2.2kR; Power Rating: 125mW; Voltage Rating: 150V; Temperature Coefficient: 100ppm/°C; Supplier 1: Digi-Key; Manufacturer Part Number: ERJ6ENF2201V; Stock 1: 189076; Pricing 1: 1 = 0,10000, 10 = 0,08700, 100 = 0,03330, 1000 = 0,01464, 2500 = 0,01264 (USD); RoHS: Yes; Mount: Surface Mount; Case/Package: 0805; Number of Pins: 2; Weight: 0.000194oz; Case Code (Metric): 2012; Case Code (Imperial): 0805; Contact Plating: Tin; Min Operating Temperature: -55°C; Max Operating Temperature: 155°C; Tolerance: 1%; Packaging: Tape and Reel; Package Quantity: 1; Composition: Thick Film; Number of Terminations: 2; Termination: SMD/SMT; Military Standard: Not; Max Power Dissipation: 125mW; Voltage Rating (DC): 150V; Features: Automotive AEC-Q200; Length: 2mm; Height: 0.6mm; Width: 0.049inch; Depth: 1.25mm; Radiation Hardening: No; REACH SVHC: No SVHC; Lead Free: Lead Free; ComponentLink1URL: https://datasheet.ciiva.com/16437/aoa0000ce2-16437797.pdf?src-supplier=Future+Electronics; ComponentLink1Description: https://datasheet.ciiva.com/16437/aoa0000ce2-16437797.pdf?src-supplier=Future+Electronics; ComponentLink2URL: https://datasheet.ciiva.com/46372/1678782-46372710.pdf?src-supplier=Element14; ComponentLink2Description: https://datasheet.ciiva.com/46372/1678782-46372710.pdf?src-supplier=Element14; ComponentLink3URL: https://datasheet.ciiva.com/24165/aoa0000ce2-24165591.pdf?src-supplier=Mouser; ComponentLink3Description: https://datasheet.ciiva.com/24165/aoa0000ce2-24165591.pdf?src-supplier=Mouser; ComponentLink4URL: https://datasheet.ciiva.com/46372/1678782-46372711.pdf?src-supplier=Element14; ComponentLink4Description: https://datasheet.ciiva.com/46372/1678782-46372711.pdf?src-supplier=Element14; ComponentLink5URL: https://datasheet.ciiva.com/22687/1678782-22687450.pdf?src-supplier=Element14; ComponentLink5Description: https://datasheet.ciiva.com/22687/1678782-22687450.pdf?src-supplier=Element14; ComponentLink6URL: https://datasheet.ciiva.com/7830/426256-7830748.pdf?src-supplier=Element14; ComponentLink6Description: https://datasheet.ciiva.com/7830/426256-7830748.pdf?src-supplier=Element14; ComponentLink7URL: https://datasheet.ciiva.com/22667/1678782-22667900.pdf?src-supplier=Element14; ComponentLink7Description: https://datasheet.ciiva.com/22667/1678782-22667900.pdf?src-supplier=Element14; ComponentLink8URL: https://datasheet.ciiva.com/7830/426256-7830990.pdf?src-supplier=Element14; ComponentLink8Description: https://datasheet.ciiva.com/7830/426256-7830990.pdf?src-supplier=Element14; Supplier Part Number 1: P2.20KCCT-ND
R7 = ERJ-6ENF7501V: Res Thick Film 7.5k 125mW, ±1%;; Manufacturer: Panasonic; Resistance: 7.5kR; Voltage Rating: 150V; Temperature Coefficient: 100ppm/°C; Supplier 1: Digi-Key; Manufacturer Part Number: ERJ-6ENF7501V; RoHS: Yes; Category: Chip SMD Resistors; Stock 1: 1517; Pricing 1: 1=0,10000, 10=0,07200, 100=0,02750, 1000=0,01210, 2500=0,01045 (USD); Mount: Surface Mount; Case/Package: 0805; Contact Plating: Tin; Case Code (Metric): 2012; Case Code (Imperial): 0805; Min Operating Temperature: -55°C; Max Operating Temperature: 155°C; Power Rating: 125mW; Tolerance: 1%; Packaging: Tape and Reel; Package Quantity: 1; Features: Automotive AEC-Q200; Max Power Dissipation: 125mW; Composition: Thick Film; Number of Terminations: 2; Termination: SMD/SMT; Military Standard: Not; Voltage Rating (DC): 150V; Length: 2mm; Height: 0.6mm; Width: 0.049inch; Depth: 1.25mm; Radiation Hardening: No; REACH SVHC: Unknown; Lead Free: Lead Free; ComponentLink1URL: https://datasheet.ciiva.com/11821/0900766b80f80784-11821713.pdf?src-supplier=RSComponents; ComponentLink1Description: https://datasheet.ciiva.com/11821/0900766b80f80784-11821713.pdf?src-supplier=RSComponents; ComponentLink2URL: https://datasheet.ciiva.com/34303/1989527-34303643.pdf?src-supplier=Jameco; ComponentLink2Description: https://datasheet.ciiva.com/34303/1989527-34303643.pdf?src-supplier=Jameco; ComponentLink3URL: https://datasheet.ciiva.com/16780/70260748-16780490.pdf?src-supplier=Allied+Electronics; ComponentLink3Description: https://datasheet.ciiva.com/16780/70260748-16780490.pdf?src-supplier=Allied+Electronics; ComponentLink4URL: https://datasheet.ciiva.com/17212/aoa0000ce2-17212477.pdf?src-supplier=Avnet+Europe; ComponentLink4Description: https://datasheet.ciiva.com/17212/aoa0000ce2-17212477.pdf?src-supplier=Avnet+Europe; ComponentLink5URL: https://datasheet.ciiva.com/30143/aoa0000ce2-30143461.pdf?src-supplier=Onlinecomponents.com; ComponentLink5Description: https://datasheet.ciiva.com/30143/aoa0000ce2-30143461.pdf?src-supplier=Onlinecomponents.com; ComponentLink6URL: https://datasheet.ciiva.com/16782/70260748-16782856.pdf?src-supplier=Allied+Electronics; ComponentLink6Description: https://datasheet.ciiva.com/16782/70260748-16782856.pdf?src-supplier=Allied+Electronics; ComponentLink7URL: https://datasheet.ciiva.com/9194/aoa0000ce2-9194794.pdf?src-supplier=Avnet; ComponentLink7Description: https://datasheet.ciiva.com/9194/aoa0000ce2-9194794.pdf?src-supplier=Avnet; ComponentLink8URL: https://datasheet.ciiva.com/46373/426256-46373996.pdf?src-supplier=Element14; ComponentLink8Description: https://datasheet.ciiva.com/46373/426256-46373996.pdf?src-supplier=Element14; ComponentLink9URL: https://datasheet.ciiva.com/28675/1678782-28675837.pdf?src-supplier=Element14; ComponentLink9Description: https://datasheet.ciiva.com/28675/1678782-28675837.pdf?src-supplier=Element14; ComponentLink10URL: https://datasheet.ciiva.com/5868/426256-5868191.pdf?src-supplier=Farnell; ComponentLink10Description: https://datasheet.ciiva.com/5868/426256-5868191.pdf?src-supplier=Farnell; Supplier Part Number 1: P7.50KCCT-ND
R8 = ERJ-6ENF1743V: Res Thick Film 174K 1% 1/8W 0805; Manufacturer: Panasonic; Voltage Rating (DC): 150V; Temperature Coefficient: 100ppm/°C; Max Power Dissipation: 125mW; Resistance: 174kR; Supplier 1: Digi-Key; Manufacturer Part Number: ERJ-6ENF1743V; RoHS: Yes; Category: Chip SMD Resistors; Stock 1: 40641; Pricing 1: 1=0,10000, 10=0,07200, 100=0,02750, 1000=0,01210, 2500=0,01045 (USD); Mount: Surface Mount; Case/Package: 0805; Contact Plating: Tin; Case Code (Imperial): 0805; Case Code (Metric): 2012; Min Operating Temperature: -55°C; Max Operating Temperature: 155°C; Termination: SMD/SMT; Composition: Thick Film; Number of Terminations: 2; Military Standard: Not; Features: Automotive AEC-Q200; Package Quantity: 1; Power Rating: 125mW; Packaging: Tape and Reel; Tolerance: 1%; Voltage Rating: 150V; Length: 2mm; Height: 0.6mm; Depth: 1.25mm; Width: 1.2mm; Lead Free: Lead Free; REACH SVHC: No SVHC; ComponentLink1URL: https://datasheet.ciiva.com/11821/0900766b80f80784-11821552.pdf?src-supplier=RSComponents; ComponentLink1Description: https://datasheet.ciiva.com/11821/0900766b80f80784-11821552.pdf?src-supplier=RSComponents; ComponentLink2URL: https://datasheet.ciiva.com/22729/1678782-22729189.pdf?src-supplier=Farnell; ComponentLink2Description: https://datasheet.ciiva.com/22729/1678782-22729189.pdf?src-supplier=Farnell; ComponentLink3URL: https://datasheet.ciiva.com/9185/aoa0000ce2-9185134.pdf?src-supplier=Avnet; ComponentLink3Description: https://datasheet.ciiva.com/9185/aoa0000ce2-9185134.pdf?src-supplier=Avnet; ComponentLink4URL: https://datasheet.ciiva.com/22739/1678782-22739676.pdf?src-supplier=Element14; ComponentLink4Description: https://datasheet.ciiva.com/22739/1678782-22739676.pdf?src-supplier=Element14; ComponentLink5URL: https://datasheet.ciiva.com/46437/1678782-46437837.pdf?src-supplier=Element14; ComponentLink5Description: https://datasheet.ciiva.com/46437/1678782-46437837.pdf?src-supplier=Element14; Supplier Part Number 1: P174KCCT-ND
R9 = ERJ-6ENF1402V: Res Thick Film 14K 1% 1/8W 0805; Manufacturer: Panasonic; Resistance: 14kR; Power Rating: 125mW; Voltage Rating: 150V; Temperature Coefficient: 100ppm/°C; Supplier 1: Digi-Key; Manufacturer Part Number: ERJ-6ENF1402V; RoHS: Yes; Category: Chip SMD Resistors; Stock 1: 87692; Pricing 1: 1=0,10000, 10=0,07200, 100=0,02750, 1000=0,01210, 2500=0,01045 (USD); Mount: Surface Mount; Case/Package: 0805; Case Code (Metric): 2012; Case Code (Imperial): 0805; Contact Plating: Tin; Min Operating Temperature: -55°C; Max Operating Temperature: 155°C; Tolerance: 1%; Packaging: Tape and Reel; Package Quantity: 1; Max Power Dissipation: 125mW; Features: Automotive AEC-Q200; Voltage Rating (DC): 150V; Composition: Thick Film; Number of Terminations: 2; Military Standard: Not; Termination: Solder; Length: 2mm; Height: 0.6mm; Width: 0.049inch; Depth: 1.25mm; Radiation Hardening: No; REACH SVHC: No SVHC; Lead Free: Lead Free; ComponentLink1URL: https://datasheet.ciiva.com/16780/70260748-16780374.pdf?src-supplier=Allied+Electronics; ComponentLink1Description: https://datasheet.ciiva.com/16780/70260748-16780374.pdf?src-supplier=Allied+Electronics; ComponentLink2URL: https://datasheet.ciiva.com/24027/aoa0000ce2-24027368.pdf?src-supplier=Mouser; ComponentLink2Description: https://datasheet.ciiva.com/24027/aoa0000ce2-24027368.pdf?src-supplier=Mouser; ComponentLink3URL: https://datasheet.ciiva.com/46373/1678782-46373848.pdf?src-supplier=Element14; ComponentLink3Description: https://datasheet.ciiva.com/46373/1678782-46373848.pdf?src-supplier=Element14; ComponentLink4URL: https://datasheet.ciiva.com/17211/aoa0000ce2-17211609.pdf?src-supplier=Avnet+Europe; ComponentLink4Description: https://datasheet.ciiva.com/17211/aoa0000ce2-17211609.pdf?src-supplier=Avnet+Europe; ComponentLink5URL: https://datasheet.ciiva.com/16787/70260748-16787401.pdf?src-supplier=Allied+Electronics; ComponentLink5Description: https://datasheet.ciiva.com/16787/70260748-16787401.pdf?src-supplier=Allied+Electronics; ComponentLink6URL: https://datasheet.ciiva.com/46373/1678782-46373849.pdf?src-supplier=Element14; ComponentLink6Description: https://datasheet.ciiva.com/46373/1678782-46373849.pdf?src-supplier=Element14; ComponentLink7URL: https://datasheet.ciiva.com/22682/1678782-22682490.pdf?src-supplier=Element14; ComponentLink7Description: https://datasheet.ciiva.com/22682/1678782-22682490.pdf?src-supplier=Element14; ComponentLink8URL: https://datasheet.ciiva.com/30191/aoa0000ce2-30191374.pdf?src-supplier=Onlinecomponents.com; ComponentLink8Description: https://datasheet.ciiva.com/30191/aoa0000ce2-30191374.pdf?src-supplier=Onlinecomponents.com; Supplier Part Number 1: P14.0KCCT-ND